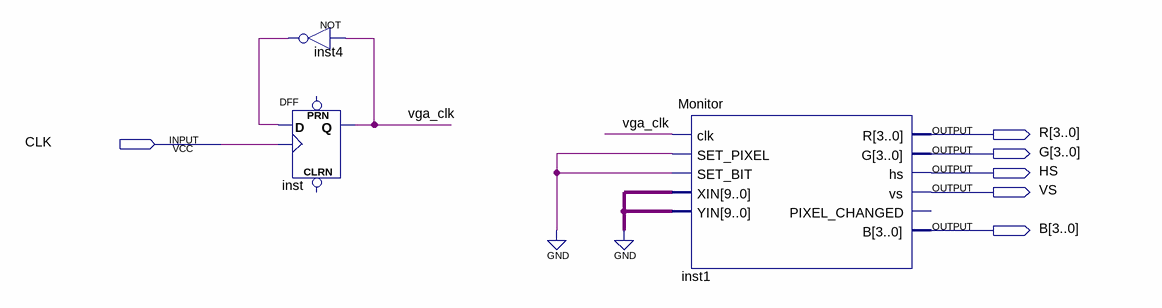
[diagram p0: schematic sheet]
// Quartus schematic VgaTest.bdf as structural Verilog: 3 symbols, 6 pins
module VgaTest (
  input  CLK,
  output [3:0] R,
  output [3:0] G,
  output HS,
  output VS,
  output [3:0] B
);

  wire inst4_out, vga_clk;

  not inst4 (inst4_out, vga_clk);
  DFF inst (.CLK(CLK), .D(inst4_out), .Q(vga_clk));  // open: CLRN, PRN
  Monitor inst1 (
    .clk(vga_clk), .SET_PIXEL(1'b0), .SET_BIT(1'b0), .XIN({10{1'b0}}), .YIN({10{1'b0}}), .R(R), .G(G),
    .hs(HS), .vs(VS), .B(B));  // open: PIXEL_CHANGED
endmodule
